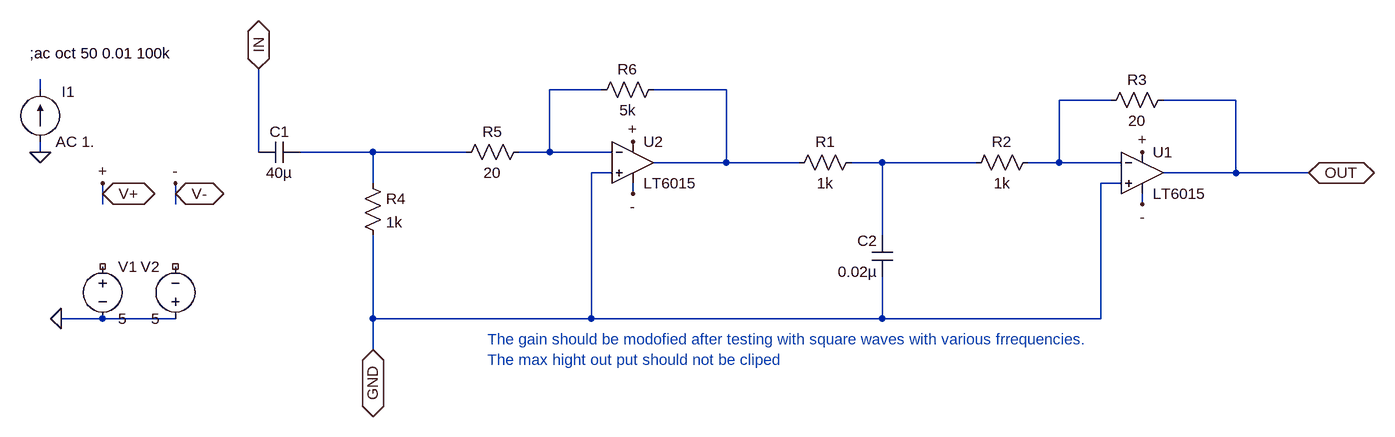
[diagram p0: schematic BPF.asc]
BPF.asc, the LTspice schematic file:
Version 4
SHEET 1 1964 804
WIRE -112 -80 -112 -96
WIRE 752 -80 672 -80
WIRE 944 -80 832 -80
WIRE 1536 -64 1456 -64
WIRE 1728 -64 1616 -64
WIRE -112 16 -112 0
WIRE 224 16 224 -112
WIRE 400 16 288 16
WIRE 544 16 400 16
WIRE 672 16 672 -80
WIRE 672 16 624 16
WIRE 768 16 672 16
WIRE 944 32 944 -80
WIRE 944 32 832 32
WIRE 1056 32 944 32
WIRE 1184 32 1136 32
WIRE 1328 32 1184 32
WIRE 1456 32 1456 -64
WIRE 1456 32 1408 32
WIRE 1552 32 1456 32
WIRE 768 48 736 48
WIRE 1728 48 1728 -64
WIRE 1728 48 1616 48
WIRE 1840 48 1728 48
WIRE 400 64 400 16
WIRE 1552 64 1520 64
WIRE -16 80 -16 64
WIRE 96 80 96 64
WIRE 800 80 800 64
WIRE -16 96 -16 80
WIRE 96 96 96 80
WIRE 1584 96 1584 80
WIRE 1184 144 1184 32
WIRE -16 272 -80 272
WIRE 96 272 -16 272
WIRE 400 272 400 144
WIRE 736 272 736 48
WIRE 736 272 400 272
WIRE 1184 272 1184 208
WIRE 1184 272 736 272
WIRE 1520 272 1520 64
WIRE 1520 272 1184 272
WIRE 400 320 400 272
FLAG -80 272 0
FLAG -16 64 +
FLAG 96 64 -
FLAG -112 16 0
FLAG 1584 16 +
FLAG 1584 96 -
FLAG 224 -112 IN
IOPIN 224 -112 BiDir
FLAG 1840 48 OUT
IOPIN 1840 48 BiDir
FLAG 400 320 GND
IOPIN 400 320 BiDir
FLAG 800 0 +
FLAG 800 80 -
FLAG -16 80 V+
IOPIN -16 80 BiDir
FLAG 96 80 V-
IOPIN 96 80 BiDir
SYMBOL cap 1200 208 R180
WINDOW 0 24 56 Left 2
WINDOW 3 24 8 Left 2
SYMATTR InstName C2
SYMATTR Value 0.02µ
SYMBOL res 1152 16 R90
WINDOW 0 0 56 VBottom 2
WINDOW 3 32 56 VTop 2
SYMATTR InstName R1
SYMATTR Value 1k
SYMBOL voltage -16 176 R0
WINDOW 123 0 0 Left 0
WINDOW 39 0 0 Left 0
SYMATTR InstName V1
SYMATTR Value 5
SYMBOL voltage 96 288 R180
WINDOW 0 24 96 Left 2
WINDOW 3 24 16 Left 2
WINDOW 123 0 0 Left 0
WINDOW 39 0 0 Left 0
SYMATTR InstName V2
SYMATTR Value 5
SYMBOL CURRENT -112 0 M180
WINDOW 0 33 77 Left 2
WINDOW 3 24 0 Left 2
SYMATTR InstName I1
SYMATTR Value AC 1.
SYMBOL Opamps\\LT6015 1584 48 R0
SYMATTR InstName U1
SYMBOL res 1424 16 R90
WINDOW 0 0 56 VBottom 2
WINDOW 3 32 56 VTop 2
SYMATTR InstName R2
SYMATTR Value 1k
SYMBOL res 1632 -80 R90
WINDOW 0 0 56 VBottom 2
WINDOW 3 32 56 VTop 2
SYMATTR InstName R3
SYMATTR Value 20
SYMBOL cap 288 0 R90
WINDOW 0 0 32 VBottom 2
WINDOW 3 32 32 VTop 2
SYMATTR InstName C1
SYMATTR Value 40µ
SYMBOL res 384 48 R0
SYMATTR InstName R4
SYMATTR Value 1k
SYMBOL Opamps\\LT6015 800 32 R0
SYMATTR InstName U2
SYMBOL res 640 0 R90
WINDOW 0 0 56 VBottom 2
WINDOW 3 32 56 VTop 2
SYMATTR InstName R5
SYMATTR Value 20
SYMBOL res 848 -96 R90
WINDOW 0 0 56 VBottom 2
WINDOW 3 32 56 VTop 2
SYMATTR InstName R6
SYMATTR Value 5k
TEXT -128 -136 Left 2 !;ac oct 50 0.01 100k
TEXT 576 304 Left 2 ;The gain should be modofied after testing with square waves with various frrequencies. \nThe max hight out put should not be cliped

The netlist it stands for:
* BPF.asc
C2 GND N006 0.02µ
R1 N006 N003 1k
V1 NC_01 0 5
V2 0 NC_02 5
I1 0 N001 AC 1.
XU1 GND N004 V+ V- OUT LT6016  ; LT6015, pins In+ In- V+ V- OUT
R2 N004 N006 1k
R3 OUT N004 20
C1 N005 IN 40µ
R4 N005 GND 1k
XU2 GND N002 V+ V- N003 LT6016  ; LT6015, pins In+ In- V+ V- OUT
R5 N002 N005 20
R6 N003 N002 5k
;ac oct 50 0.01 100k
* The gain should be modofied after testing with square waves with various frrequencies.
* The max hight out put should not be cliped
.lib LTC2.lib
.backanno
.end